# EAGLE design ARM Arduino Mega Board v2 (EAGLE 7.6.0)
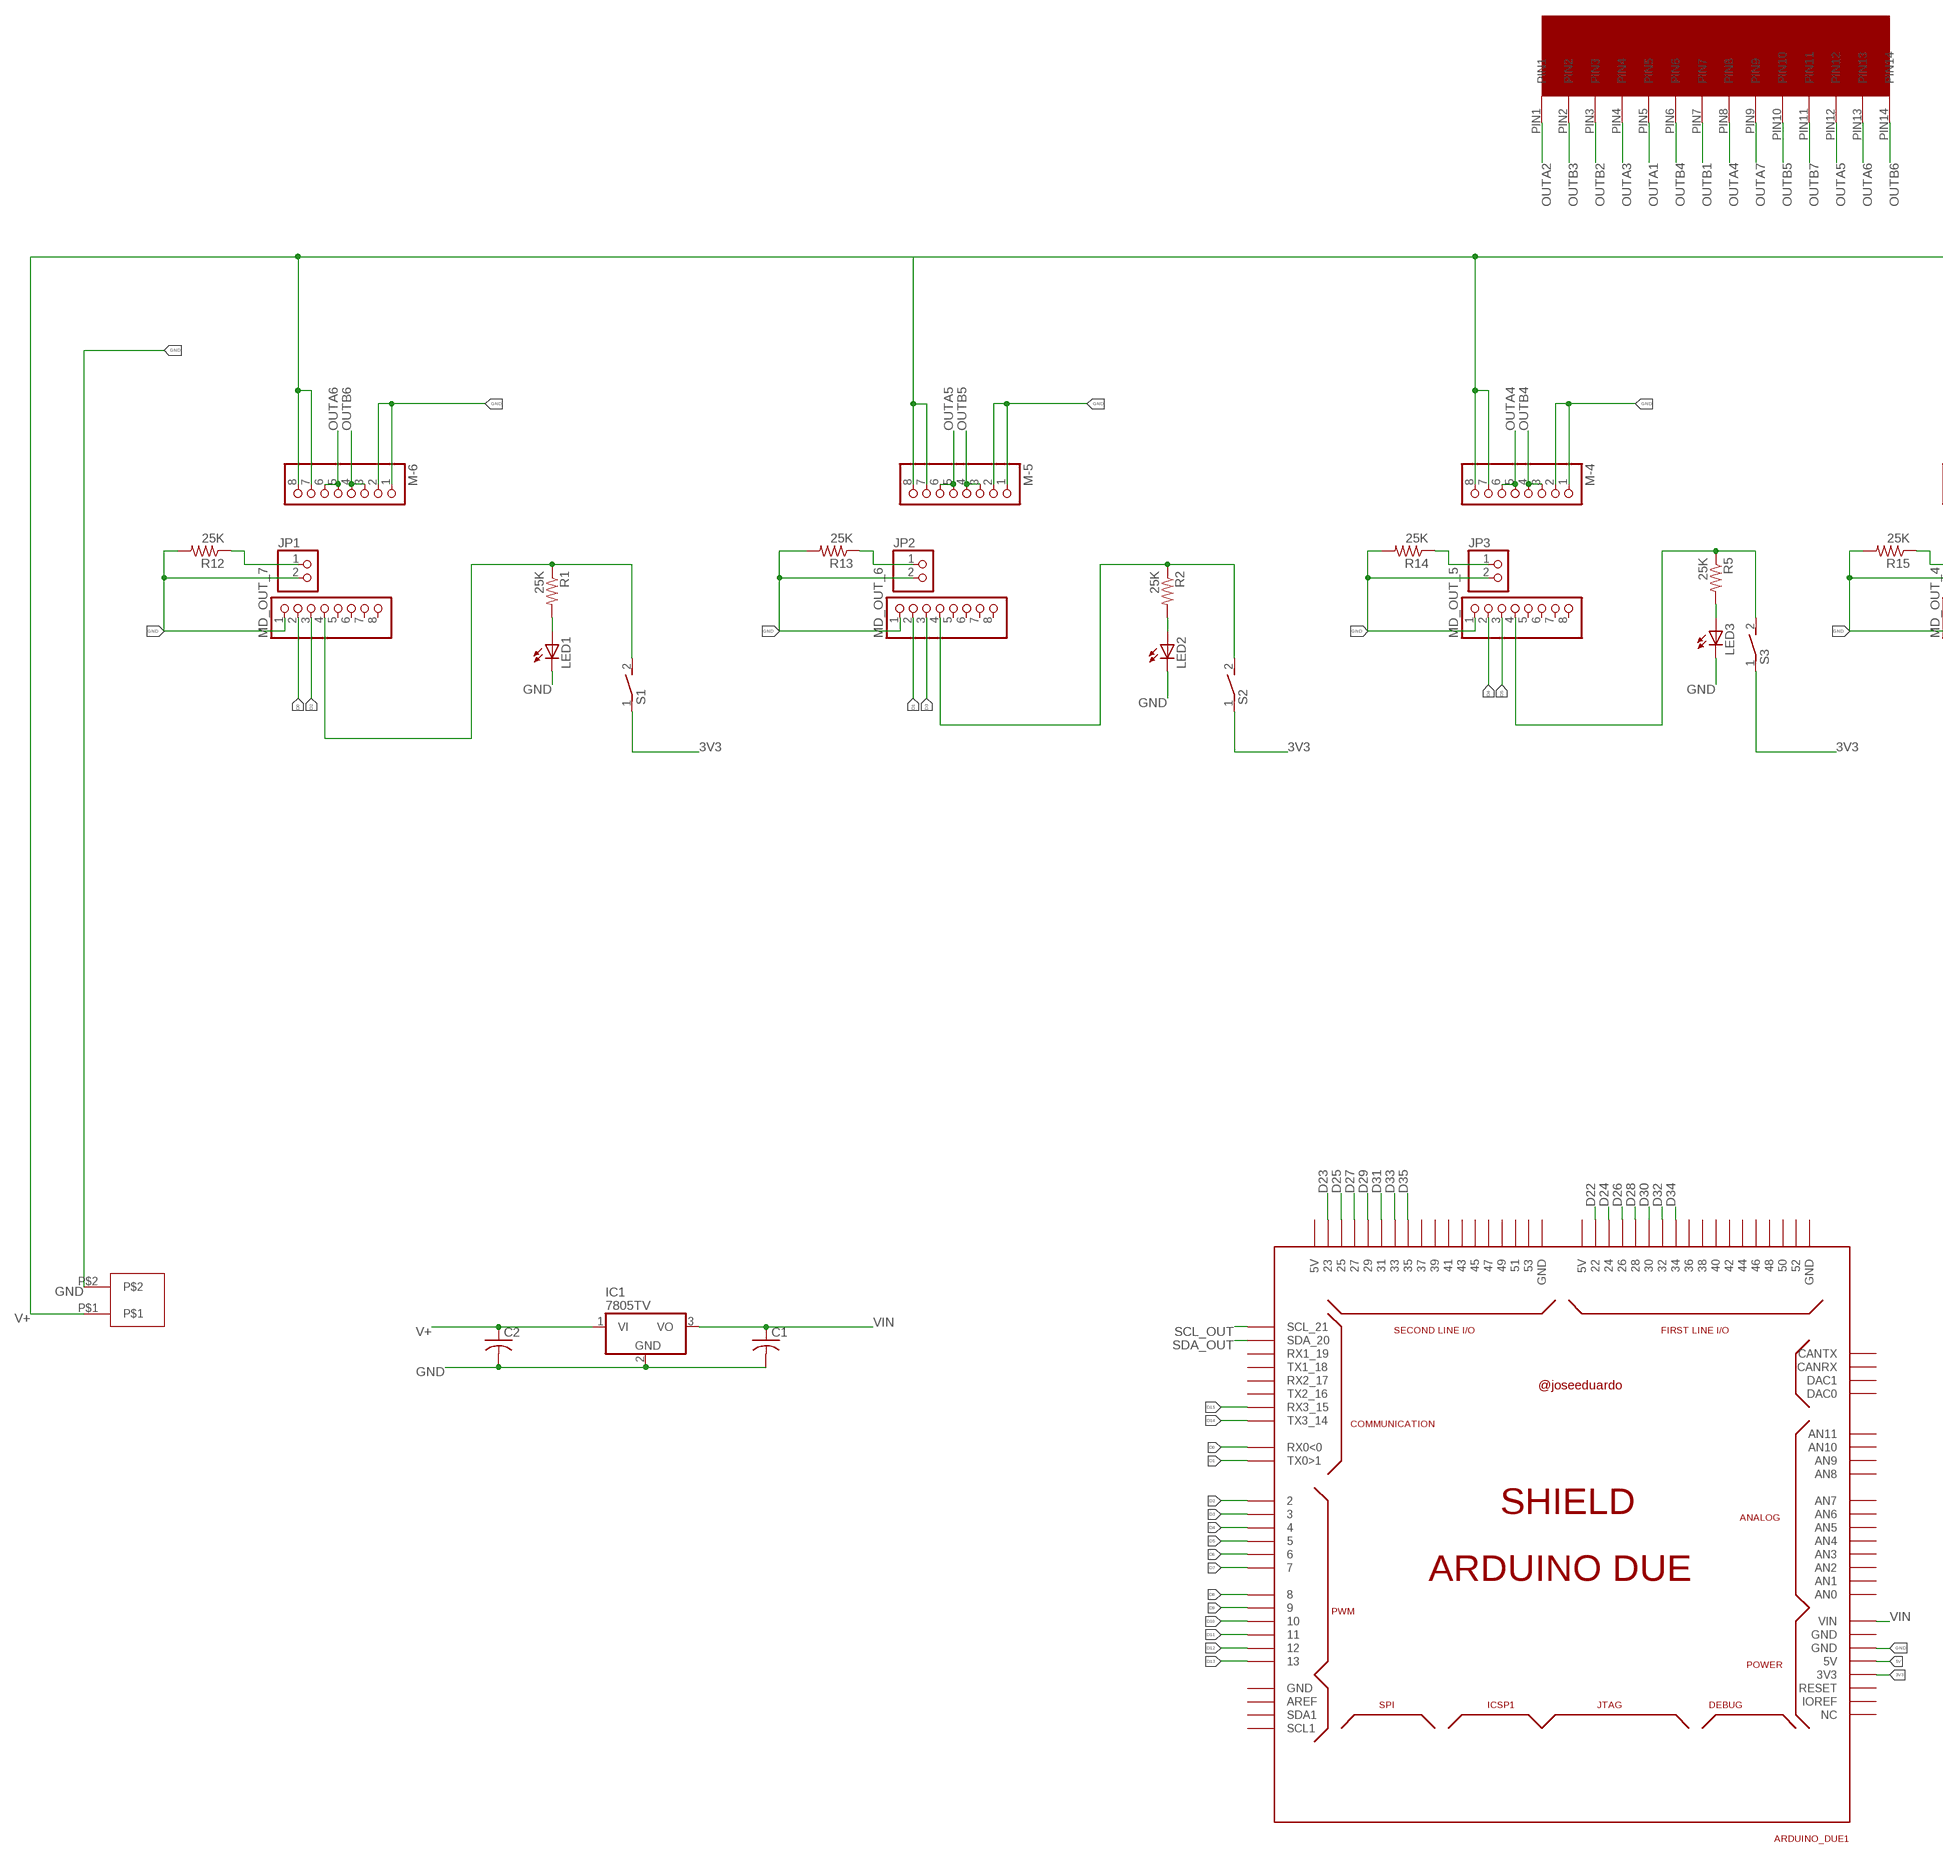
[diagram p0: schematic, sheet 1, part 1 of 2]
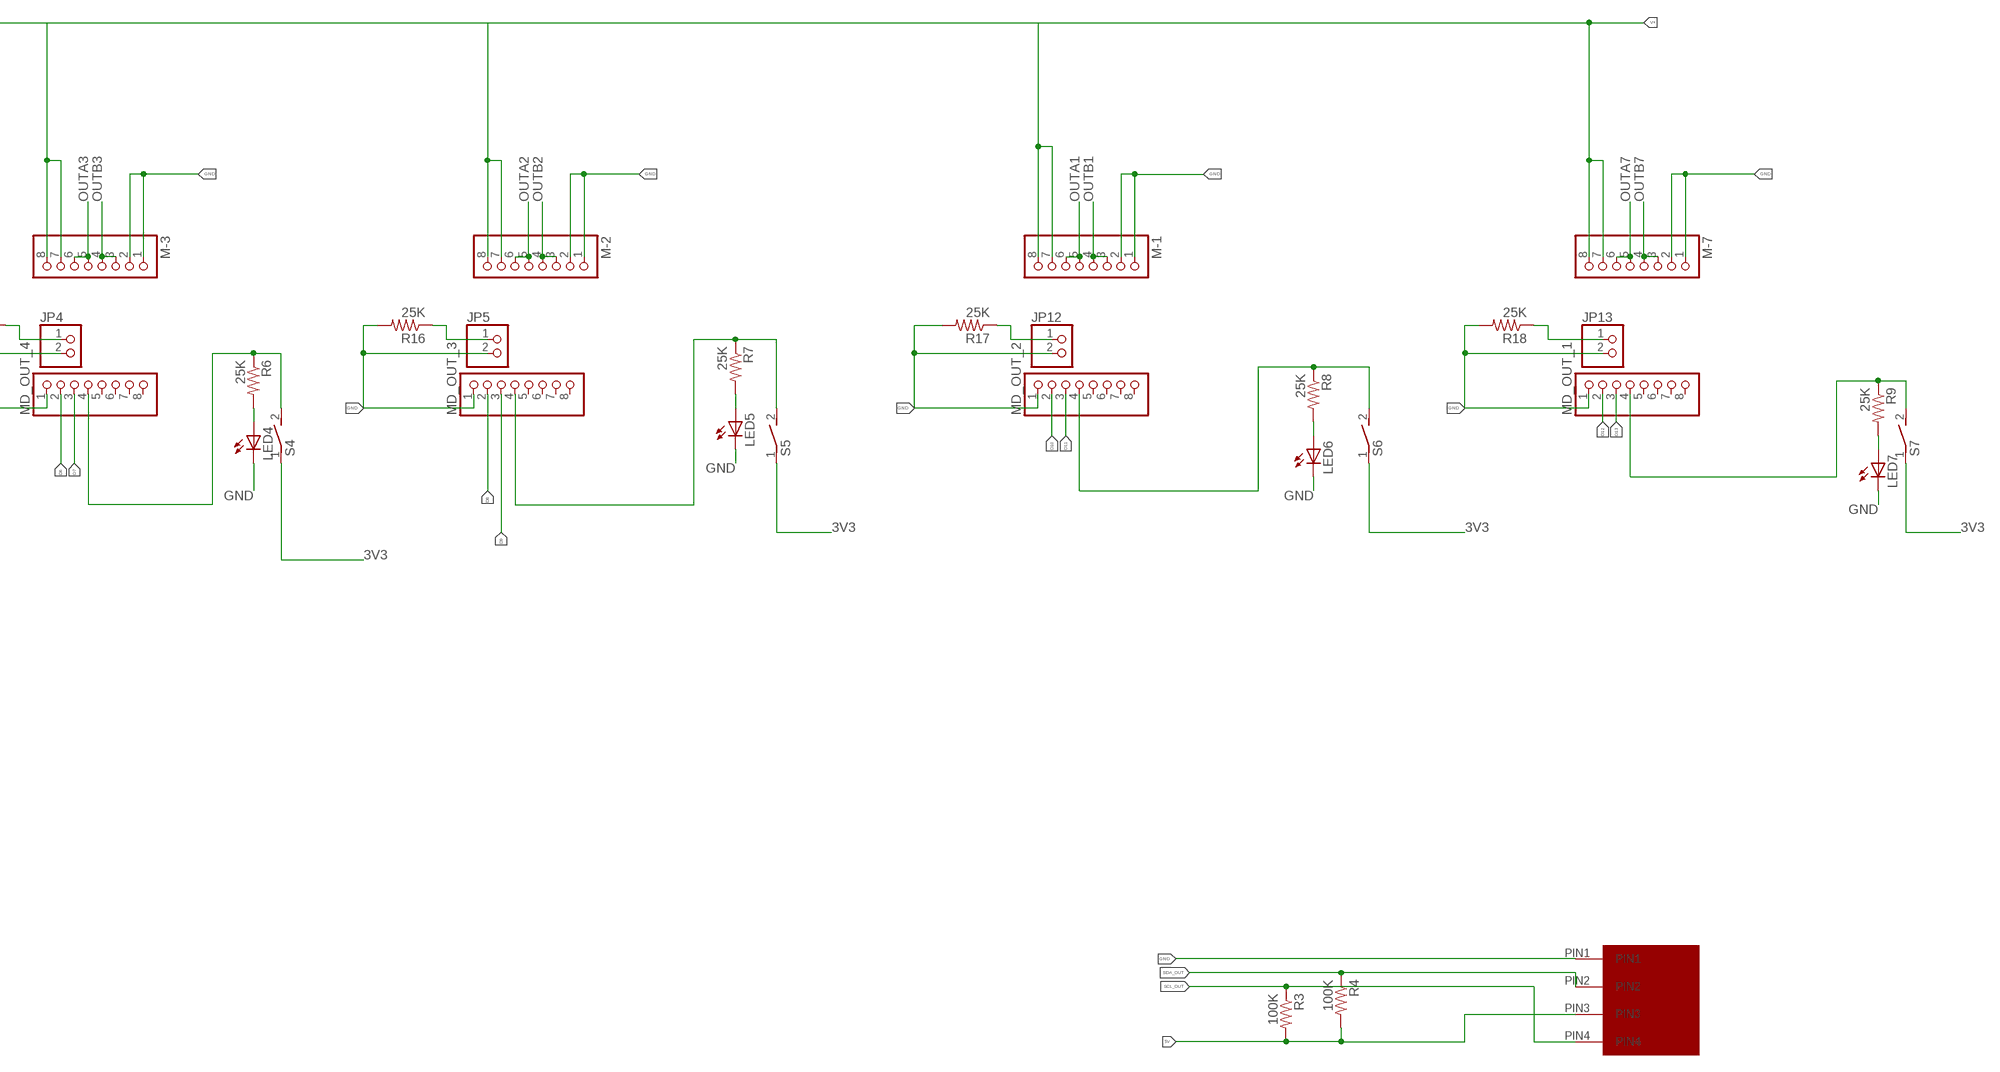
[diagram p1: schematic, sheet 1, part 2 of 2]

## Parts
ARDUINO_DUE1  ARDUINO_DUE_SHIELD  [ARDUINO_DUE_SHIELD]
C1  C-US050-045X075  [C050-045X075]
C2  C-US050-045X075  [C050-045X075]
IC1  7805TV  [TO220V]
JP1  PINHD-1X2  [1X02]
JP2  PINHD-1X2  [1X02]
JP3  PINHD-1X2  [1X02]
JP4  PINHD-1X2  [1X02]
JP5  PINHD-1X2  [1X02]
JP12  PINHD-1X2  [1X02]
JP13  PINHD-1X2  [1X02]
LED1  LEDCHIP-LED0603  [CHIP-LED0603]
LED2  LEDCHIP-LED0603  [CHIP-LED0603]
LED3  LEDCHIP-LED0603  [CHIP-LED0603]
LED4  LEDCHIP-LED0603  [CHIP-LED0603]
LED5  LEDCHIP-LED0603  [CHIP-LED0603]
LED6  LEDCHIP-LED0603  [CHIP-LED0603]
LED7  LEDCHIP-LED0603  [CHIP-LED0603]
M-1  PINHD-1X8  [1X08]
M-2  PINHD-1X8  [1X08]
M-3  PINHD-1X8  [1X08]
M-4  PINHD-1X8  [1X08]
M-5  PINHD-1X8  [1X08]
M-6  PINHD-1X8  [1X08]
M-7  PINHD-1X8  [1X08]
MD_OUT_1  PINHD-1X8  [1X08]
MD_OUT_2  PINHD-1X8  [1X08]
MD_OUT_3  PINHD-1X8  [1X08]
MD_OUT_4  PINHD-1X8  [1X08]
MD_OUT_5  PINHD-1X8  [1X08]
MD_OUT_6  PINHD-1X8  [1X08]
MD_OUT_7  PINHD-1X8  [1X08]
R1  25K  R-US_R0603  [R0603]
R2  25K  R-US_R0603  [R0603]
R3  100K  R-US_R0603  [R0603]
R4  100K  R-US_R0603  [R0603]
R5  25K  R-US_R0603  [R0603]
R6  25K  R-US_R0603  [R0603]
R7  25K  R-US_R0603  [R0603]
R8  25K  R-US_R0603  [R0603]
R9  25K  R-US_R0603  [R0603]
R12  25K  R-US_R0603  [R0603]
R13  25K  R-US_R0603  [R0603]
R14  25K  R-US_R0603  [R0603]
R15  25K  R-US_R0603  [R0603]
R16  25K  R-US_R0603  [R0603]
R17  25K  R-US_R0603  [R0603]
R18  25K  R-US_R0603  [R0603]
S1  DS01E  [DS-01]
S2  DS01E  [DS-01]
S3  DS01E  [DS-01]
S4  DS01E  [DS-01]
S5  DS01E  [DS-01]
S6  DS01E  [DS-01]
S7  DS01E  [DS-01]
U$1  MEGA-FIT_RA_2  [MEGA-FIT_RA_2]
U$2  14PINULTRAFIT  [14PINULTRAFIT]
U$3  4PIN_ULTRA_FIT  [4PIN_ULTRA_FIT]

## Nets
3V3: ARDUINO_DUE1.3V3 S1.1 S2.1 S3.1 S4.1 S5.1 S6.1 S7.1
5V: ARDUINO_DUE1.5V0(5V) R3.2 R4.2 U$3.PIN3
D0: ARDUINO_DUE1.0(RX0<0) MD_OUT_7.2
D1: ARDUINO_DUE1.1(TX0>1) MD_OUT_6.2
D2: ARDUINO_DUE1.2 MD_OUT_7.3
D3: ARDUINO_DUE1.3 MD_OUT_6.3
D4: ARDUINO_DUE1.4 MD_OUT_5.2
D5: ARDUINO_DUE1.5 MD_OUT_5.3
D6: ARDUINO_DUE1.6 MD_OUT_4.2
D7: ARDUINO_DUE1.7 MD_OUT_4.3
D8: ARDUINO_DUE1.8 MD_OUT_3.2
D9: ARDUINO_DUE1.9 MD_OUT_3.3
D10: ARDUINO_DUE1.10 MD_OUT_2.2
D11: ARDUINO_DUE1.11 MD_OUT_2.3
D12: ARDUINO_DUE1.12 MD_OUT_1.2
D13: ARDUINO_DUE1.13 MD_OUT_1.3
D14: ARDUINO_DUE1.14(TX3_14)
D15: ARDUINO_DUE1.15(RX3_15)
D22: ARDUINO_DUE1.22
D23: ARDUINO_DUE1.23
D24: ARDUINO_DUE1.24
D25: ARDUINO_DUE1.25
D26: ARDUINO_DUE1.26
D27: ARDUINO_DUE1.27
D28: ARDUINO_DUE1.28
D29: ARDUINO_DUE1.29
D30: ARDUINO_DUE1.30
D31: ARDUINO_DUE1.31
D32: ARDUINO_DUE1.32
D33: ARDUINO_DUE1.33
D34: ARDUINO_DUE1.34
D35: ARDUINO_DUE1.35
GND: ARDUINO_DUE1.GND C1.2 C2.2 IC1.2(GND) JP1.2 JP2.2 JP3.2 JP4.2 JP5.2 JP12.2 JP13.2 LED1.C LED2.C LED3.C LED4.C LED5.C LED6.C LED7.C M-1.1 M-1.2 M-2.1 M-2.2 M-3.1 M-3.2 M-4.1 M-4.2 M-5.1 M-5.2 M-6.1 M-6.2 M-7.1 M-7.2 MD_OUT_1.1 MD_OUT_2.1 MD_OUT_3.1 MD_OUT_4.1 MD_OUT_5.1 MD_OUT_6.1 MD_OUT_7.1 R12.2 R13.2 R14.2 R15.2 R16.2 R17.2 R18.2 U$1.P$2 U$3.PIN1
N1: MD_OUT_2.4 R8.1 S6.2
N2: MD_OUT_3.4 R7.1 S5.2
N3: MD_OUT_4.4 R6.1 S4.2
N4: MD_OUT_5.4 R5.1 S3.2
N5: MD_OUT_6.4 R2.1 S2.2
N6: MD_OUT_7.4 R1.1 S1.2
N7: MD_OUT_1.4 R9.1 S7.2
N$1: LED1.A R1.2
N$3: LED2.A R2.2
N$4: JP1.1 R12.1
N$5: JP2.1 R13.1
N$6: JP3.1 R14.1
N$7: JP4.1 R15.1
N$8: JP5.1 R16.1
N$9: JP12.1 R17.1
N$10: JP13.1 R18.1
N$28: LED3.A R5.2
N$30: LED4.A R6.2
N$32: LED5.A R7.2
N$34: LED6.A R8.2
N$36: LED7.A R9.2
OUTA1: M-1.5 M-1.6 U$2.PIN5
OUTA2: M-2.5 M-2.6 U$2.PIN1
OUTA3: M-3.5 M-3.6 U$2.PIN4
OUTA4: M-4.5 M-4.6 U$2.PIN8
OUTA5: M-5.5 M-5.6 U$2.PIN12
OUTA6: M-6.5 M-6.6 U$2.PIN13
OUTA7: M-7.5 M-7.6 U$2.PIN9
OUTB1: M-1.3 M-1.4 U$2.PIN7
OUTB2: M-2.3 M-2.4 U$2.PIN3
OUTB3: M-3.3 M-3.4 U$2.PIN2
OUTB4: M-4.3 M-4.4 U$2.PIN6
OUTB5: M-5.3 M-5.4 U$2.PIN10
OUTB6: M-6.3 M-6.4 U$2.PIN14
OUTB7: M-7.3 M-7.4 U$2.PIN11
SCL_OUT: ARDUINO_DUE1.21(SCL_21) R3.1 U$3.PIN4
SDA_OUT: ARDUINO_DUE1.20(SDA_20) R4.1 U$3.PIN2
V+: C2.1 IC1.1(VI) M-1.7 M-1.8 M-2.7 M-2.8 M-3.7 M-3.8 M-4.7 M-4.8 M-5.7 M-5.8 M-6.7 M-6.8 M-7.7 M-7.8 U$1.P$1
VIN: ARDUINO_DUE1.VIN C1.1 IC1.3(VO)
Unconnected: ARDUINO_DUE1.5V0_1(5V) ARDUINO_DUE1.5V0_2(5V) ARDUINO_DUE1.16(TX2_16) ARDUINO_DUE1.17(RX2_17) ARDUINO_DUE1.18(TX1_18) ARDUINO_DUE1.19(RX1_19) ARDUINO_DUE1.36 ARDUINO_DUE1.37 ARDUINO_DUE1.38 ARDUINO_DUE1.39 ARDUINO_DUE1.40 ARDUINO_DUE1.41 ARDUINO_DUE1.42 ARDUINO_DUE1.43 ARDUINO_DUE1.44 ARDUINO_DUE1.45 ARDUINO_DUE1.46 ARDUINO_DUE1.47 ARDUINO_DUE1.48 ARDUINO_DUE1.49 ARDUINO_DUE1.50 ARDUINO_DUE1.51 ARDUINO_DUE1.52 ARDUINO_DUE1.53 ARDUINO_DUE1.A0(AN0) ARDUINO_DUE1.A1(AN1) ARDUINO_DUE1.A2(AN2) ARDUINO_DUE1.A3(AN3) ARDUINO_DUE1.A4(AN4) ARDUINO_DUE1.A5(AN5) ARDUINO_DUE1.A6(AN6) ARDUINO_DUE1.A7(AN7) ARDUINO_DUE1.A8(AN8) ARDUINO_DUE1.A9(AN9) ARDUINO_DUE1.A10(AN10) ARDUINO_DUE1.A11(AN11) ARDUINO_DUE1.AREF ARDUINO_DUE1.CANRX ARDUINO_DUE1.CANTX ARDUINO_DUE1.DAC0 ARDUINO_DUE1.DAC1 ARDUINO_DUE1.GND_1(GND) ARDUINO_DUE1.GND_2(GND) ARDUINO_DUE1.GND_3(GND) ARDUINO_DUE1.GND_4(GND) ARDUINO_DUE1.IOREF ARDUINO_DUE1.NC_2(NC) ARDUINO_DUE1.RESET ARDUINO_DUE1.SCL1 ARDUINO_DUE1.SDA1 MD_OUT_1.5 MD_OUT_1.6 MD_OUT_1.7 MD_OUT_1.8 MD_OUT_2.5 MD_OUT_2.6 MD_OUT_2.7 MD_OUT_2.8 MD_OUT_3.5 MD_OUT_3.6 MD_OUT_3.7 MD_OUT_3.8 MD_OUT_4.5 MD_OUT_4.6 MD_OUT_4.7 MD_OUT_4.8 MD_OUT_5.5 MD_OUT_5.6 MD_OUT_5.7 MD_OUT_5.8 MD_OUT_6.5 MD_OUT_6.6 MD_OUT_6.7 MD_OUT_6.8 MD_OUT_7.5 MD_OUT_7.6 MD_OUT_7.7 MD_OUT_7.8

## Library data of the parts
ARDUINO_DUE1 = arduino_due_shield:ARDUINO_DUE_SHIELD
C1 C2 = adafruit:C-US: CAPACITOR, American symbol
IC1 = linear:78*: Positive VOLTAGE REGULATOR Source: http://cache.national.com/ds/LM/LM78L05.pdf http://www.fairchildsemi.com/ds/LM/LM7805.pdf
JP1-JP5 JP12 JP13 = pinhead:PINHD-1X2: PIN HEADER
LED1-LED7 = led:LED: LED OSRAM: - CHIPLED LG R971, LG N971, LY N971, LG Q971, LY Q971, LO R971, LY R971 LH N974, LH R974 LS Q976, LO Q976, LY Q976 LO Q996 - Hyper CHIPLED LW Q18S LB Q993, LB Q99A, LB R99A - SideLED LS A670, LO A670, LY A670, LG A670, LP A670 LB A673, LV A673, LT A673, LW A673 LH A674 LY A675 LS A676, LA A676, LO A676, LY A676, LW A676 LS A679, LY A679, LG A679 - Hyper Micro SIDELED® LS Y876, LA Y876, LO Y876, LY Y876 LT Y87S - SmartLED LW L88C, LW L88S LB L89C, LB L89S, LG L890 LS L89K, LO L89K, LY L89K LS L896, LA L896, LO L896, LY L896 - TOPLED LS T670, LO T670, LY T670, LG T670, LP T670 LSG T670, LSP T670, LSY T670, LOP T670, LYG T670 LG T671, LOG T671, LSG T671 LB T673, LV T673, LT T673, LW T673 LH T674 LS T676, LA T676, LO T676, LY T676, LB T676, LH T676, LSB T676, LW T676 LB T67C, LV T67C, LT T67C, LS T67K, LO T67K, LY T67K, LW E67C LS E67B, LA E67B, LO E67B, LY E67B, LB E67C, LV E67C, LT E67C LW T67C LS T679, LY T679, LG T679 LS T770, LO T770, LY T770, LG T770, LP T770 LB T773, LV T773, LT T773, LW T773 LH T774 LS E675, LA E675, LY E675, LS T675 LS T776, LA T776, LO T776, LY T776, LB T776 LHGB T686 LT T68C, LB T68C - Hyper Mini TOPLED® LB M676 - Mini TOPLED Santana® LG M470 LS M47K, LO M47K, LY M47K Source: http://www.osram.convergy.de LUXEON: - LUMILED® LXK2-PW12-R00, LXK2-PW12-S00, LXK2-PW14-U00, LXK2-PW14-V00 LXK2-PM12-R00, LXK2-PM12-S00, LXK2-PM14-U00 LXK2-PE12-Q00, LXK2-PE12-R00, LXK2-PE12-S00, LXK2-PE14-T00, LXK2-PE14-U00 LXK2-PB12-K00, LXK2-PB12-L00, LXK2-PB12-M00, LXK2-PB14-N00, LXK2-PB14-P00, LXK2-PB14-Q00 LXK2-PR12-L00, LXK2-PR12-M00, LXK2-PR14-Q00, LXK2-PR14-R00 LXK2-PD12-Q00, LXK2-PD12-R00, LXK2-PD12-S00 LXK2-PH12-R00, LXK2-PH12-S00 LXK2-PL12-P00, LXK2-PL12-Q00, LXK2-PL12-R00 Source: www.luxeon.com KINGBRIGHT: KA-3528ASYC Source: www.kingbright.com
M-1-M-7 MD_OUT_1-MD_OUT_7 = pinhead:PINHD-1X8: PIN HEADER
R1-R9 R12-R18 = rcl:R-US_: RESISTOR, American symbol; SPICEPREFIX: R
S1-S7 = switch-dil:DS01E: DIL/CODE SWITCH; OC_FARNELL: unknown; OC_NEWARK: unknown
U$1 = RSX:MEGA-FIT_RA_2
U$2 = RSXrelay:14PINULTRAFIT
U$3 = RSXrelay:4PIN_ULTRA_FIT

## Board
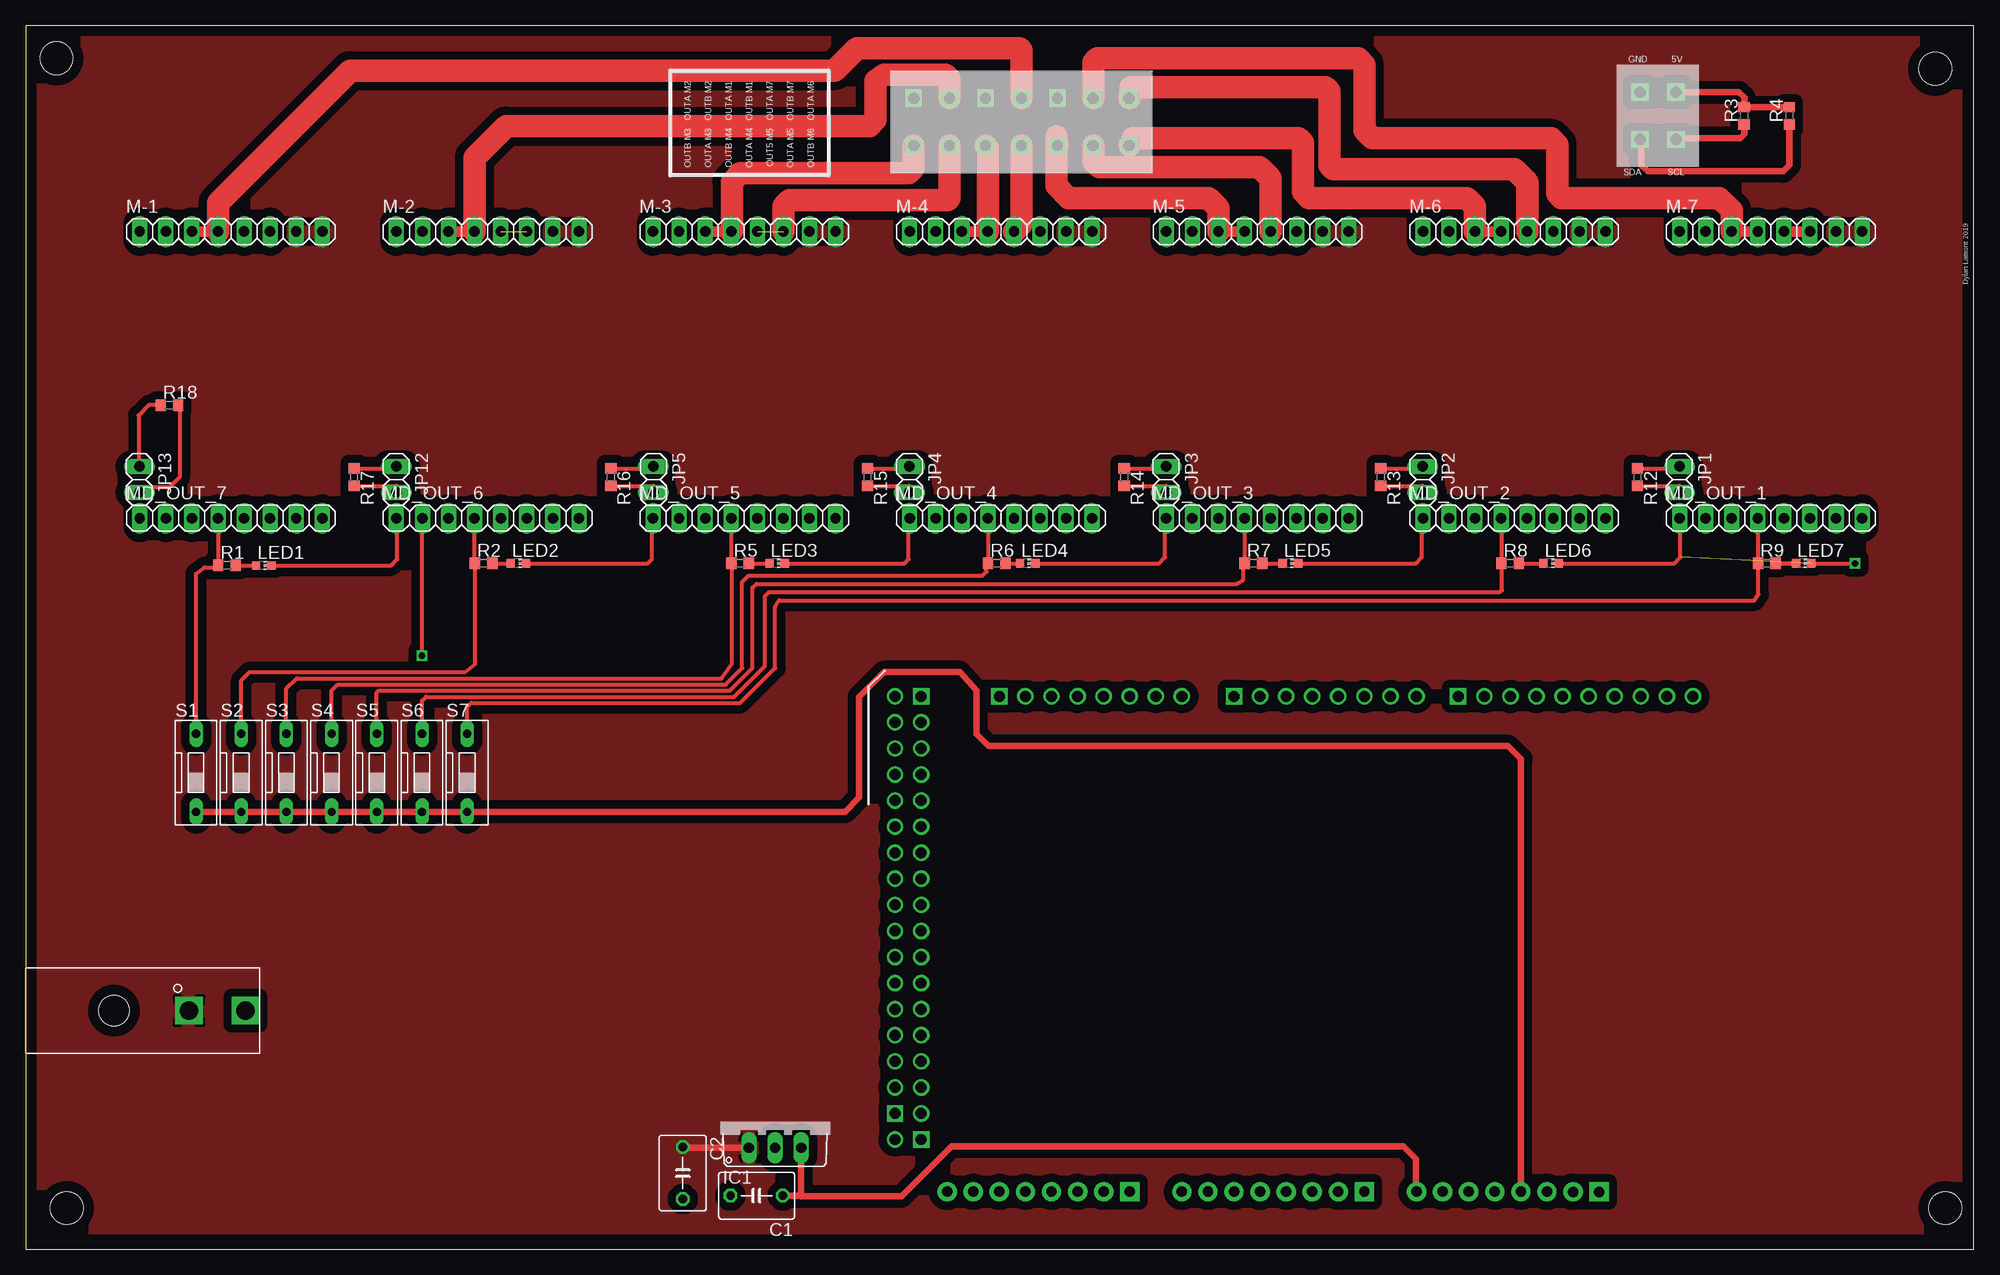
[diagram p2: board, top side]
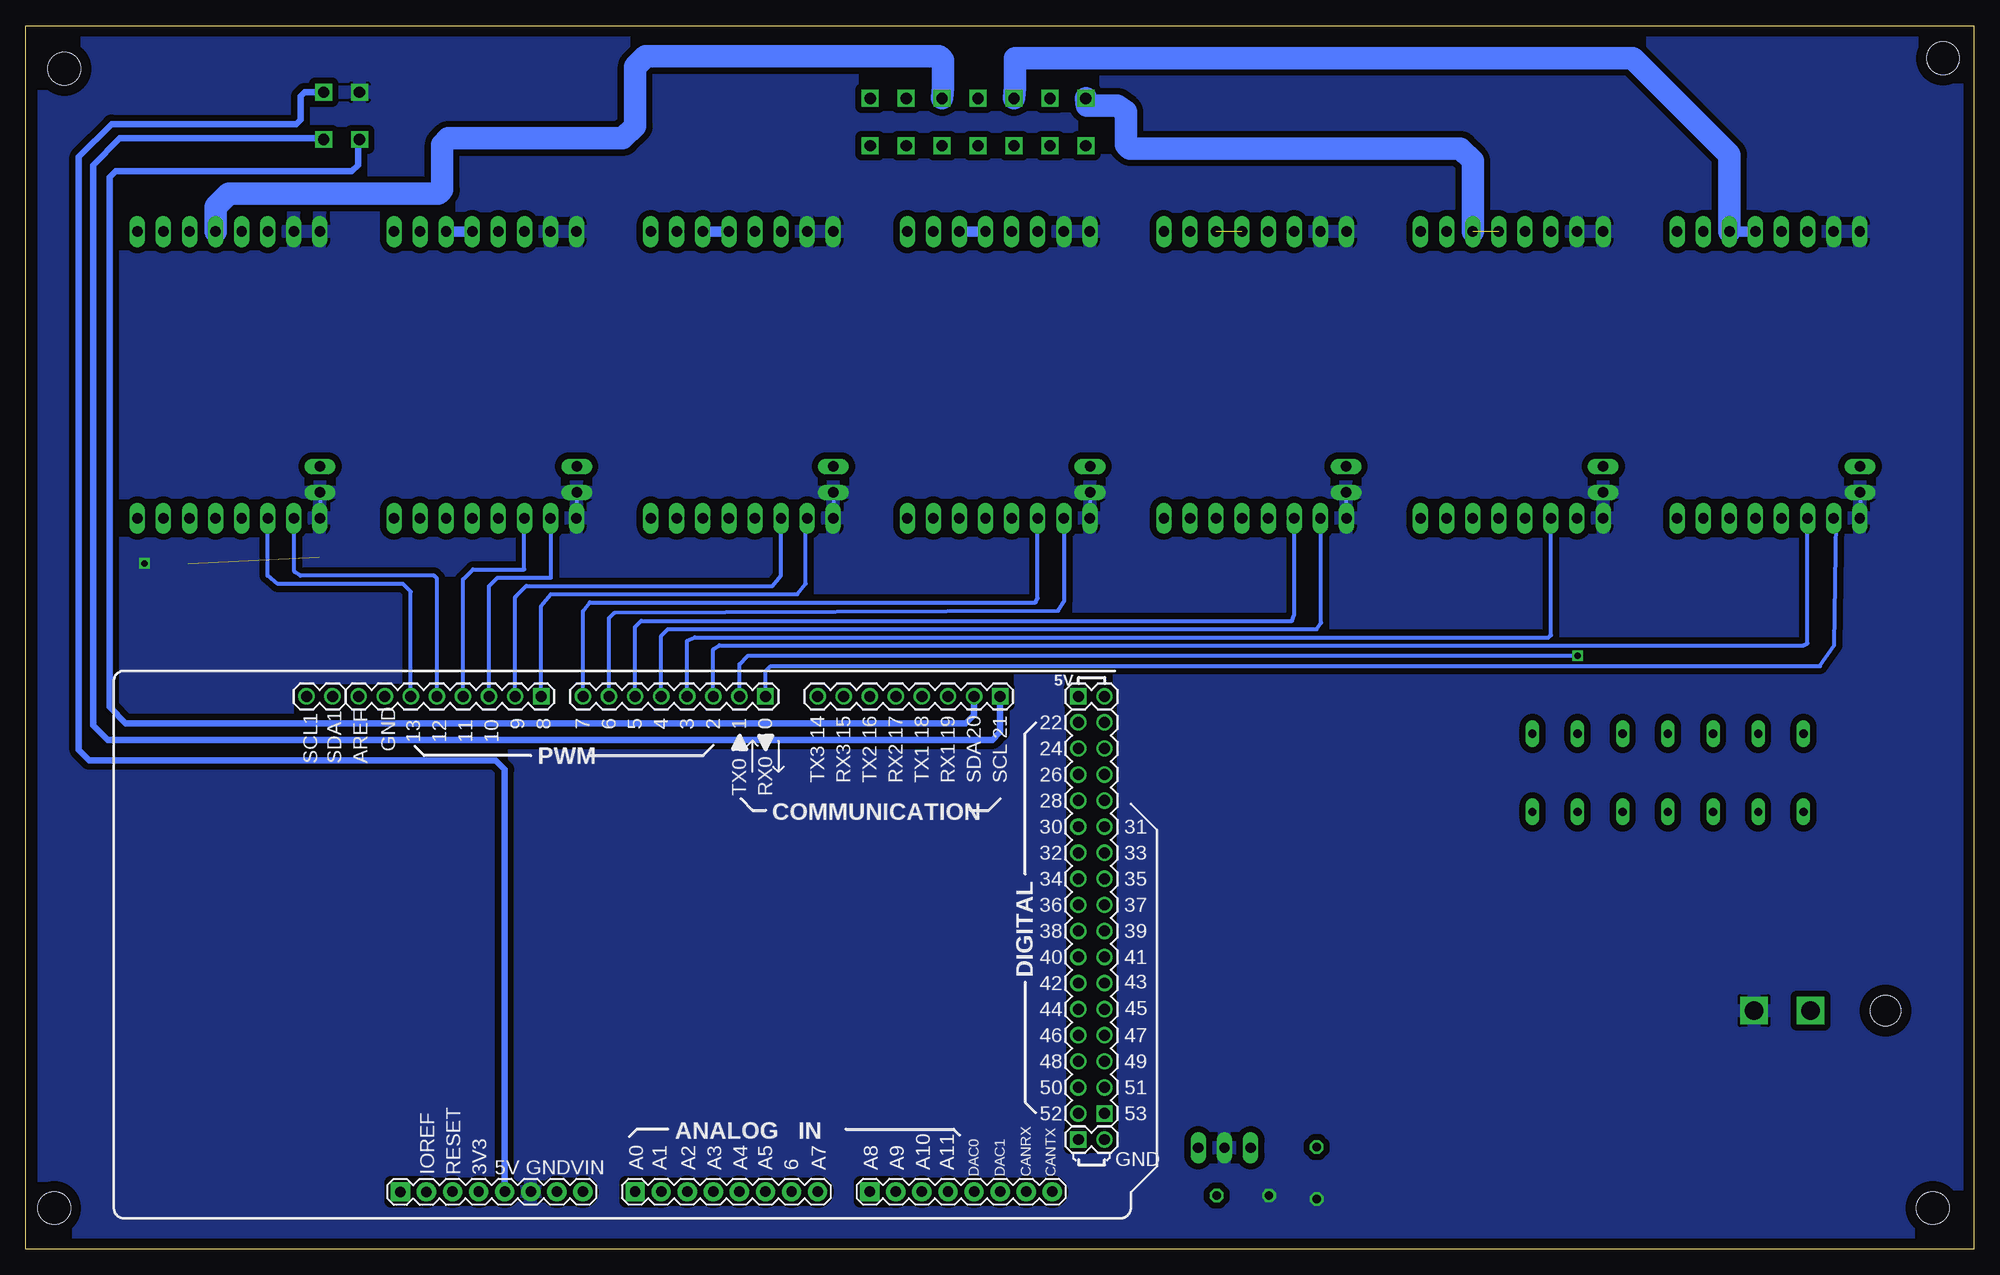
[diagram p3: board, bottom side, seen from below]

Size 189.77 x 119.18 mm. Coordinates in mm from the lower left corner, seen from the top.
Outline: 0,0 189.77,0 189.77,119.18 0,119.18 0,0
Copper layers (1*16): Top 0.035mm / dielectric 1.5mm / Bottom 0.035mm
Design rules "default": minimum track width 10mil, minimum drill 24mil, track to track 8mil, track to pad 8mil, pad to pad 8mil, via to via 8mil, smd to smd 8mil, copper to edge 40mil, drill to drill 8mil, minimum pad ring 10mil, minimum via ring 8mil, stop-mask expansion 4mil, vias tented up to drill 0mil, thermal gap 10mil
Holes 3.2 mm at 3,116 186,115 187,4 4,4

### Footprints (pad centres in the part's own frame; a part is rotated, then mirrored left to right if it is on the bottom)
ARDUINO_DUE_SHIELD = drill 1.067 square: 0 63.373,51.816; 5V0_1 93.853,51.816; 8 41.529,51.816; 21 86.233,51.816; 53 96.393,11.176; GND_2 93.853,8.636 | drill 1.067: 1 60.833,51.816; 2 58.293,51.816; 3 55.753,51.816; 4 53.213,51.816; 5 50.673,51.816; 5V0_2 96.393,51.816; 6 48.133,51.816; 7 45.593,51.816; 9 38.989,51.816; 10 36.449,51.816; 11 33.909,51.816; 12 31.369,51.816; 13 28.829,51.816; 14 68.453,51.816; 15 70.993,51.816; 16 73.533,51.816; 17 76.073,51.816; 18 78.613,51.816; 19 81.153,51.816; 20 83.693,51.816; 22 93.853,49.276; 23 96.393,49.276; 24 93.853,46.736; 25 96.393,46.736; 26 93.853,44.196; 27 96.393,44.196; 28 93.853,41.656; 29 96.393,41.656; 30 93.853,39.116; 31 96.393,39.116; 32 93.853,36.576; 33 96.393,36.576; 34 93.853,34.036; 35 96.393,34.036; 36 93.853,31.496; 37 96.393,31.496; 38 93.853,28.956; 39 96.393,28.956; 40 93.853,26.416; 41 96.393,26.416; 42 93.853,23.876; 43 96.393,23.876; 44 93.853,21.336; 45 96.393,21.336; 46 93.853,18.796; 47 96.393,18.796; 48 93.853,16.256; 49 96.393,16.256; 50 93.853,13.716; 51 96.393,13.716; 52 93.853,11.176; AREF 23.749,51.816; GND_3 96.393,8.636; GND_4 26.289,51.816; SCL1 18.669,51.816; SDA1 21.209,51.816 | drill 1.016 pad 1.88: 3V3 35.433,3.556; 5V0 37.973,3.556; A1 53.213,3.556; A2 55.753,3.556; A3 58.293,3.556; A4 60.833,3.556; A5 63.373,3.556; A6 65.913,3.556; A7 68.453,3.556; A9 76.073,3.556; A10 78.613,3.556; A11 81.153,3.556; CANRX 88.773,3.556; CANTX 91.313,3.556; DAC0 83.693,3.556; DAC1 86.233,3.556; GND 40.513,3.556; GND_1 43.053,3.556; IOREF 30.346,3.543; RESET 32.893,3.555; VIN 45.593,3.556 | drill 1.016 pad 1.88 square: A0 50.673,3.556; A8 73.533,3.556; NC_2 27.806,3.543
C050-045X075 = drill 0.813 octagon: 1 -2.54,0; 2 2.54,0
TO220V = drill 1.016 long: 1 -2.54,-2.54; 2 0,-2.54; 3 2.54,-2.54
1X02 = drill 1.016 long: 1 -1.27,0; 2 1.27,0
CHIP-LED0603 = smd 0.8 x 0.8: A 0,-0.75; C 0,0.75
1X08 = drill 1.016 long: 1 -8.89,0; 2 -6.35,0; 3 -3.81,0; 4 -1.27,0; 5 1.27,0; 6 3.81,0; 7 6.35,0; 8 8.89,0
R0603 = smd 1 x 1.1: 1 -0.85,0; 2 0.85,0
DS-01 = drill 0.813 long: 1 0,-3.81; 2 0,3.81
MEGA-FIT_RA_2 = drill 1.8 square: P$1 4.175,15.9; P$2 4.175,21.4 | hole 3: 4.175,8.6
14PINULTRAFIT = drill 1.1 square: PIN1 -10.5,2.3; PIN2 -10.5,-2.3; PIN3 -7,2.3; PIN4 -7,-2.3; PIN5 -3.5,2.3; PIN6 -3.5,-2.3; PIN7 0,2.3; PIN8 0,-2.3; PIN9 3.5,2.3; PIN10 3.5,-2.3; PIN11 7,2.3; PIN12 7,-2.3; PIN13 10.5,2.3; PIN14 10.5,-2.3
4PIN_ULTRA_FIT = drill 1.1 square: PIN1 -1.75,2.3; PIN2 -1.75,-2.3; PIN3 1.75,2.3; PIN4 1.75,-2.3

### Placement (x,y rotation side)
ARDUINO_DUE1  181.08,2.03 0 bottom
C1  71.2,5.2 180 top
C2  64,7.4 270 top
IC1  73,12.4 0 top
JP1  161.09,74.98 270 top
JP2  136.09,74.98 270 top
JP3  111.09,74.98 270 top
JP4  86.09,74.98 270 top
JP5  61.15,74.98 270 top
JP12  36.1,74.98 270 top
JP13  11.08,74.98 270 top
LED1  23.2,66.6 270 top
LED2  48,66.8 270 top
LED3  73.2,66.8 270 top
LED4  97.6,66.8 270 top
LED5  123.2,66.8 270 top
LED6  148.6,66.8 270 top
LED7  173.2,66.8 270 top
M-1  20,99.12 0 top
M-2  45,99.12 0 top
M-3  70,99.12 0 top
M-4  95,99.12 0 top
M-5  120,99.12 0 top
M-6  145,99.12 0 top
M-7  170,99.12 0 top
MD_OUT_1  170,71.2 0 top
MD_OUT_2  145,71.2 0 top
MD_OUT_3  120,71.2 0 top
MD_OUT_4  95,71.2 0 top
MD_OUT_5  70,71.2 0 top
MD_OUT_6  45,71.2 0 top
MD_OUT_7  20,71.2 0 top
R1  19.6,66.6 0 top
R2  44.6,66.8 0 top
R3  167.4,110.4 90 top
R4  171.8,110.4 90 top
R5  69.6,66.8 0 top
R6  94.6,66.8 0 top
R7  119.6,66.8 0 top
R8  144.6,66.8 0 top
R9  169.6,66.8 0 top
R12  157,75.2 270 top
R13  132,75.2 270 top
R14  107,75.2 270 top
R15  82,75.2 270 top
R16  57,75.2 270 top
R17  32,75.2 270 top
R18  14,82.2 0 top
S1  16.6,46.4 0 top
S2  21,46.4 0 top
S3  25.4,46.4 0 top
S4  29.8,46.4 0 top
S5  34.2,46.4 0 top
S6  38.6,46.4 0 top
S7  43,46.4 0 top
U$1  0,27.4 270 top
U$2  97,109.8 0 top
U$3  159,110.4 0 top

### Tracks (layer width: path | path; a pad name or v marks a point on that pad's centre or on a via)
3V3
  Top 0.61: ARDUINO_DUE1.3V3 145.65,47.75 144.4,49 93.8,49 92.6,50.2 92.6,54.4 91,56.2 83.6,56.2 81.2,53.8 81.2,44 79.8,42.6 S7.1 S6.1 S5.1 S4.1 S3.1 S2.1 S1.1
5V
  Top 0.61: U$3.PIN3 166.9,112.7 167.4,112.2 R3.2 R4.2
  Bottom 0.61: ARDUINO_DUE1.5V0 143.11,46.71 144,47.6 183.6,47.6 184.6,48.6 184.6,106.4 181.4,109.6 163.4,109.6 163,110 163,112.3 162.6,112.7 U$3.PIN3 160.85,112.8
D0
  Bottom 0.406: ARDUINO_DUE1.0 117.71,56.29 117.2,56.8 15,56.8 13.6,58.8 13.4,70.95 MD_OUT_7.2
D1  (via drill 0.6)
  Top 0.406: v38.6,57.8 38.6,71.15 MD_OUT_6.2
  Bottom 0.406: ARDUINO_DUE1.1 120.25,56.95 119.4,57.8 v38.6,57.8
D2
  Bottom 0.406: ARDUINO_DUE1.2 122.79,58.41 122.2,58.8 16.6,58.8 16.2,59 MD_OUT_7.3
D3
  Bottom 0.406: ARDUINO_DUE1.3 125.33,59.27 124.6,59.6 41.4,59.6 41.2,59.8 MD_OUT_6.3
D4
  Bottom 0.406: ARDUINO_DUE1.4 127.87,59.73 127.2,60.4 64,60.4 63.6,61 63.6,71.15 MD_OUT_5.2
D5
  Bottom 0.406: ARDUINO_DUE1.5 130.41,60.59 129.8,61.2 66.4,61.2 66.2,61.8 MD_OUT_5.3
D6
  Bottom 0.406: ARDUINO_DUE1.6 132.95,61.45 132.4,62 89.2,62.2 88.6,63.2 88.6,71.15 MD_OUT_4.2
D7
  Bottom 0.406: ARDUINO_DUE1.7 135.49,62.11 134.8,63 91.4,63 91.2,63.4 MD_OUT_4.3
D8
  Bottom 0.406: ARDUINO_DUE1.8 139.55,62.65 138.6,63.8 114.6,63.8 113.8,64.8 113.8,71.05 MD_OUT_3.2
D9
  Bottom 0.406: ARDUINO_DUE1.9 142.09,63.51 141,64.6 117,64.6 116.2,65.6 MD_OUT_3.3
D10
  Bottom 0.406: ARDUINO_DUE1.10 144.63,64.57 143.8,65.4 138.6,65.4 138.6,71.15 MD_OUT_2.2
D11
  Bottom 0.406: ARDUINO_DUE1.11 147.17,65.23 146.2,66.2 141.2,66.2 MD_OUT_2.3
D12
  Bottom 0.406: ARDUINO_DUE1.12 149.71,65.31 150,65.6 163,65.6 163.6,66 163.6,71.15 MD_OUT_1.2
D13
  Bottom 0.406: ARDUINO_DUE1.13 152.25,64.05 153,64.8 165.2,64.8 166.2,65.6 MD_OUT_1.3
GND  (via drill 0.6)  (1 unrouted)
  Top 0.406: R12.2 161.09,74.35 JP1.2 | R13.2 136.09,74.35 JP2.2 | R14.2 111.09,74.35 JP3.2 | R15.2 86.09,74.35 JP4.2 | R16.2 61.15,74.35 JP5.2 | R17.2 36.1,74.35 JP12.2 | R18.2 15,82.2 15,75.2 14,74.2 11.57,74.2 JP13.2 | LED1.C 35.6,66.6 36.2,67.2 36.2,71.11 MD_OUT_6.1 | LED2.C 60.6,66.8 61,67.2 61,71.09 MD_OUT_5.1 | LED3.C 85.6,66.8 86,67.2 86,71.09 MD_OUT_4.1 | LED4.C 110.4,66.8 111,67.4 111,71.09 MD_OUT_3.1 | LED5.C 135.4,66.8 136,67.4 136,71.09 MD_OUT_2.1 | LED6.C 160.6,66.8 161.2,67.4 161.2,71.11 MD_OUT_1.1 | LED7.C v178.2,66.8
  Bottom 0.406: JP13.2 11.08,71.23 MD_OUT_7.1 | JP5.2 61.15,71.24 MD_OUT_5.1 | JP4.2 86.09,71.22 MD_OUT_4.1 | JP1.2 161.09,71.22 MD_OUT_1.1 | JP2.2 136.09,71.22 MD_OUT_2.1 | JP3.2 111.09,71.22 MD_OUT_3.1
  pour Bottom (isolate 0.61): 2,118 187,118 188,117 188,5 185,1 3,1 1,4 1,117
N1
  Top 0.406: S6.2 38.6,53.4 39,53.8 69,53.8 72,56.8 72,63.6 72.4,64 143.6,64 143.8,64.2 143.8,66.75 R8.1 143.73,66.82 MD_OUT_2.4
N2
  Top 0.406: S5.2 34.2,54.2 34.4,54.4 68.6,54.4 70.8,56.6 70.8,64.4 71.2,64.8 118,64.8 118.6,65.2 118.6,66.65 R7.1 118.73,66.82 MD_OUT_3.4
N3
  Top 0.406: S4.2 29.8,54.4 30.4,55 68.2,55 69.8,56.6 69.8,65 70.4,65.6 93.2,65.6 93.6,66 93.6,66.65 R6.1 93.73,66.82 MD_OUT_4.4
N4
  Top 0.406: S3.2 25.4,54.6 26.4,55.6 67.8,55.6 68.8,57 68.8,66.75 R5.1 68.75,71.18 MD_OUT_5.4
N5
  Top 0.406: S2.2 21,55.4 21.8,56.2 42.8,56.2 43.8,57 43.8,66.75 R2.1 43.75,71.18 MD_OUT_6.4
N6
  Top 0.406: S1.2 16.6,65.8 17.4,66.4 18.55,66.4 R1.1 18.73,66.62 MD_OUT_7.4
N7
  Top 0.406: S7.2 43,52.8 43.4,53.2 69.6,53.2 73,56.6 73,62.6 73.4,63.2 168.4,63.2 168.8,63.8 168.8,66.75 R9.1 168.73,66.82 MD_OUT_1.4
N$1
  Top 0.406: R1.2 LED1.A
N$3
  Top 0.406: R2.2 LED2.A
N$4
  Top 0.406: R12.1 161.09,76.05 JP1.1
N$5
  Top 0.406: R13.1 136.09,76.05 JP2.1
N$6
  Top 0.406: R14.1 111.09,76.05 JP3.1
N$7
  Top 0.406: R15.1 86.09,76.05 JP4.1
N$8
  Top 0.406: R16.1 61.15,76.05 JP5.1
N$9
  Top 0.406: R17.1 36.1,76.05 JP12.1
N$10
  Top 0.406: R18.1 12,82.2 11,81.2 11,76.33 JP13.1
N$28
  Top 0.406: R5.2 LED3.A
N$30
  Top 0.406: R6.2 LED4.A
N$32
  Top 0.406: R7.2 LED5.A
N$34
  Top 0.406: R8.2 LED6.A
N$36
  Top 0.406: R9.2 LED7.A
OUTA1
  Bottom 1.016: M-1.5 M-1.6
  Bottom 2.184: M-1.6 23.81,106.61 33.2,116 93.4,116 93.4,113.2 U$2.PIN5
OUTA2  (1 unrouted)
  Bottom 2.184: M-2.6 48.81,106.01 50,107.2 82.2,107.2 82.6,107.6 82.6,110.8 83.4,111.4 86.4,111.4 U$2.PIN1
OUTA3  (1 unrouted)
  Top 2.184: M-3.6 73.81,101.61 74.4,102.2 89.8,102.2 90,102.4 U$2.PIN4
OUTA4
  Top 2.184: U$2.PIN8 97,99.85 M-4.5
  Bottom 1.016: M-4.5 M-4.6
OUTA5
  Top 2.184: M-5.5 121.27,104.33 120.2,105.4 104.6,105.4 104,106 U$2.PIN12
  Bottom 1.016: M-5.5 M-5.6
OUTA6
  Top 2.184: M-6.5 146.27,103.93 145,105.2 127.4,105.2 127,105.6 127,112.8 126.6,113.2 107.6,113.2 U$2.PIN13
  Bottom 1.016: M-6.5 M-6.6
OUTA7
  Top 1.016: M-7.6 M-7.5
  Bottom 2.184: U$2.PIN9 100.4,113.2 100.4,115.8 100.8,116.2 129.4,116.2 130.4,115.2 130.4,109.4 131.6,108.2 148.6,108.2 149.2,107.6 149.2,103.2 149.6,102.8 170,102.8 171.27,101.53 M-7.5
OUTB1
  Top 1.016: M-1.4 M-1.3
  Top 2.184: M-1.4 18.73,101.93 31.6,114.8 78.8,114.8 81,117 96.8,117 97,116.8 U$2.PIN7
OUTB2
  Top 1.016: M-2.3 M-2.4
  Top 2.184: M-2.4 43.73,106.33 46.8,109.4 82.2,109.4 82.8,110 82.8,113.8 83.6,114.4 89.6,114.4 90,114 U$2.PIN3
OUTB3
  Top 1.016: M-3.3 M-3.4
  Top 2.184: U$2.PIN2 86.5,105.3 86,104.8 69.6,104.8 68.8,104 68.8,99.19 M-3.4
OUTB4
  Top 1.016: M-4.3 M-4.4
  Top 2.184: M-4.4 93.73,107.27 U$2.PIN6
OUTB5
  Top 1.016: M-5.3 M-5.4
  Top 2.184: M-5.3 116.19,101.41 115.2,102.4 101.6,102.4 100.4,103.6 100.4,108.4 U$2.PIN10
OUTB6
  Top 1.016: M-6.3 M-6.4
  Top 2.184: M-6.3 141.19,101.61 140.4,102.4 125,102.4 124.4,103 124.4,107.8 124,108.2 107.8,108.2 U$2.PIN14
OUTB7
  Top 1.016: M-7.4 M-7.3
  Top 2.184: U$2.PIN11 104,115.6 104.4,116 129.8,116 130.4,115.4 130.4,109 131.2,108.2 148.6,108.2 149.2,107.6 149.2,102.8 149.6,102.4 165,102.4 166.19,101.21 M-7.3
SCL_OUT
  Top 0.61: R3.1 167.4,108.6 167,108.2 160.85,108.2 U$3.PIN4
  Bottom 0.61: ARDUINO_DUE1.21 94.85,50.35 95.6,49.6 181.8,49.6 183.2,51 183.2,105.6 180.6,108.2 160.85,108.2 U$3.PIN4
SDA_OUT
  Top 0.61: R4.1 171.8,105.6 171.2,105 158,105 157.4,105.6 157.4,107.95 U$3.PIN2
  Bottom 0.61: ARDUINO_DUE1.20 97.39,52.01 98.2,51.2 180,51.2 181.6,52.8 181.6,104.4 181,105 158,105 157.4,105.6 157.4,107.95 U$3.PIN2
V+
  Top 0.61: IC1.1 64.08,9.86 C2.1
  pour Top (isolate 0.813): 1,118 187,118 188,117 188,2 3,2 1,4
VIN
  Top 0.61: IC1.3 75.54,5.14 | 75.54,5.14 75.4,5.2 C1.1 | ARDUINO_DUE1.VIN 135.4,5.67 135.4,8.8 134.2,10 90.2,10 85.34,5.14 75.54,5.14

### Text on the board
tNames: GND | 5V | OUTA M2 | OUTB M2 | OUTA M1 | OUTB M1 | OUTA M7 | OUTB M7 | OUTA M6 | OUTB M3 | OUTA M3 | OUTB M4 | OUTA M4 | OUT5 M5 | OUTA M5 | OUTB M6 | SDA | SCL | Dylan Lamont 2019